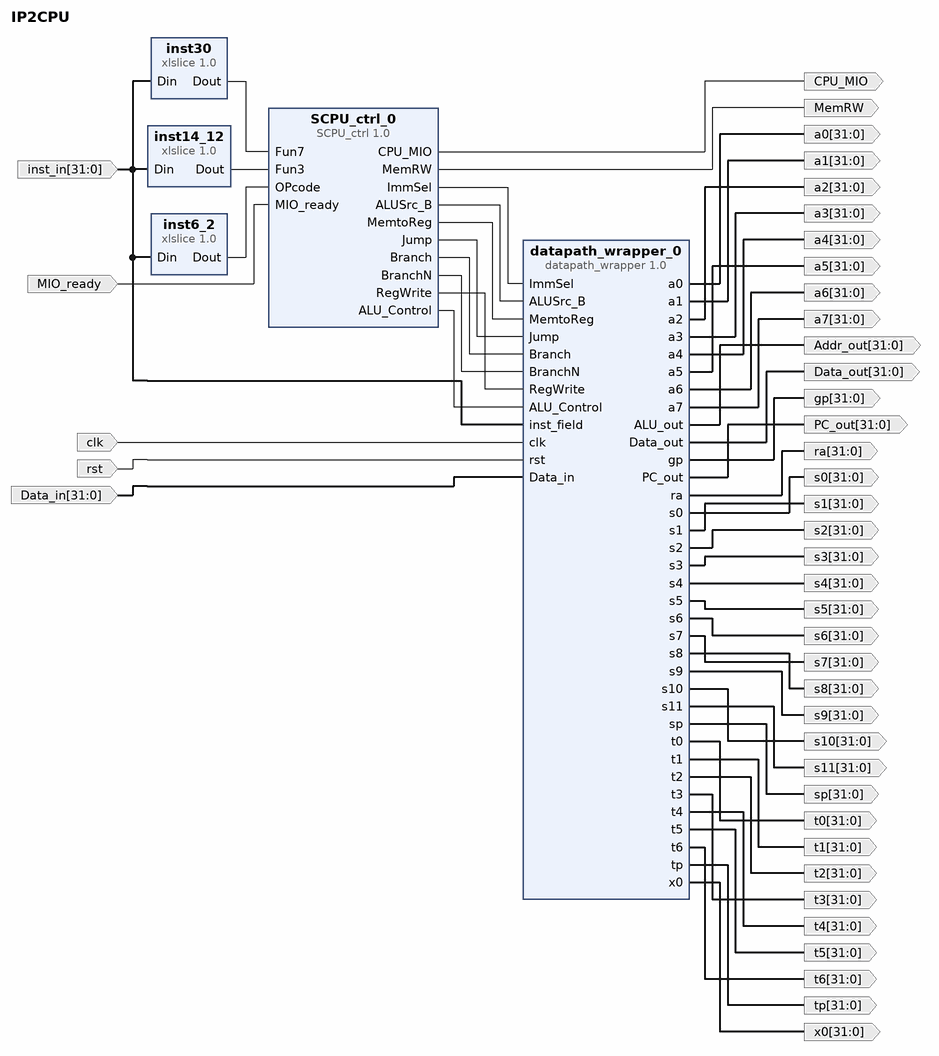
[diagram p0: block diagram of the top level]
# Vivado block design IP2CPU, xc7k160tffg676-2L, Vivado 2020.2
create_bd_design IP2CPU

create_bd_port -dir I MIO_ready
create_bd_port -dir I -type clk clk
create_bd_port -dir I -type rst rst
create_bd_port -dir I -from 31 -to 0 inst_in
create_bd_port -dir O MemRW
create_bd_port -dir O CPU_MIO
create_bd_port -dir O -from 31 -to 0 Addr_out
create_bd_port -dir O -from 31 -to 0 Data_out
create_bd_port -dir O -from 31 -to 0 PC_out
create_bd_port -dir O -from 31 -to 0 a0
create_bd_port -dir O -from 31 -to 0 a1
create_bd_port -dir O -from 31 -to 0 a2
create_bd_port -dir O -from 31 -to 0 a3
create_bd_port -dir O -from 31 -to 0 a4
create_bd_port -dir O -from 31 -to 0 a5
create_bd_port -dir O -from 31 -to 0 a6
create_bd_port -dir O -from 31 -to 0 a7
create_bd_port -dir O -from 31 -to 0 gp
create_bd_port -dir O -from 31 -to 0 ra
create_bd_port -dir O -from 31 -to 0 s0
create_bd_port -dir O -from 31 -to 0 s1
create_bd_port -dir O -from 31 -to 0 s10
create_bd_port -dir O -from 31 -to 0 s11
create_bd_port -dir O -from 31 -to 0 s2
create_bd_port -dir O -from 31 -to 0 s3
create_bd_port -dir O -from 31 -to 0 s4
create_bd_port -dir O -from 31 -to 0 s5
create_bd_port -dir O -from 31 -to 0 s6
create_bd_port -dir O -from 31 -to 0 s7
create_bd_port -dir O -from 31 -to 0 s8
create_bd_port -dir O -from 31 -to 0 s9
create_bd_port -dir O -from 31 -to 0 sp
create_bd_port -dir O -from 31 -to 0 t0
create_bd_port -dir O -from 31 -to 0 t1
create_bd_port -dir O -from 31 -to 0 t2
create_bd_port -dir O -from 31 -to 0 t3
create_bd_port -dir O -from 31 -to 0 t4
create_bd_port -dir O -from 31 -to 0 t5
create_bd_port -dir O -from 31 -to 0 t6
create_bd_port -dir O -from 31 -to 0 tp
create_bd_port -dir O -from 31 -to 0 x0
create_bd_port -dir I -from 31 -to 0 Data_in

create_bd_cell -type ip -vlnv xilinx.com:user:SCPU_ctrl:1.0 SCPU_ctrl_0
create_bd_cell -type ip -vlnv xilinx.com:user:datapath_wrapper:1.0 datapath_wrapper_0
create_bd_cell -type ip -vlnv xilinx.com:ip:xlslice:1.0 inst14_12
set_property -dict {CONFIG.DIN_FROM 14 CONFIG.DIN_TO 12 CONFIG.DOUT_WIDTH 3} [get_bd_cells inst14_12]
create_bd_cell -type ip -vlnv xilinx.com:ip:xlslice:1.0 inst30
set_property -dict {CONFIG.DIN_FROM 30 CONFIG.DIN_TO 30 CONFIG.DOUT_WIDTH 1} [get_bd_cells inst30]
create_bd_cell -type ip -vlnv xilinx.com:ip:xlslice:1.0 inst6_2
set_property -dict {CONFIG.DIN_FROM 6 CONFIG.DIN_TO 2 CONFIG.DOUT_WIDTH 5} [get_bd_cells inst6_2]

# ---- connections ----

connect_bd_net [get_bd_pins inst30/Dout] [get_bd_pins SCPU_ctrl_0/Fun7]
connect_bd_net [get_bd_pins inst14_12/Dout] [get_bd_pins SCPU_ctrl_0/Fun3]
connect_bd_net [get_bd_pins inst6_2/Dout] [get_bd_pins SCPU_ctrl_0/OPcode]
connect_bd_net -net MIO_ready_0_1 [get_bd_ports MIO_ready] [get_bd_pins SCPU_ctrl_0/MIO_ready]
connect_bd_net -net clk_0_1 [get_bd_ports clk] [get_bd_pins datapath_wrapper_0/clk]
connect_bd_net -net rst_0_1 [get_bd_ports rst] [get_bd_pins datapath_wrapper_0/rst]
connect_bd_net -net inst_field_0_1 [get_bd_ports inst_in] \
  [get_bd_pins datapath_wrapper_0/inst_field] [get_bd_pins inst14_12/Din] [get_bd_pins inst30/Din] [get_bd_pins inst6_2/Din]
connect_bd_net [get_bd_pins SCPU_ctrl_0/ImmSel] [get_bd_pins datapath_wrapper_0/ImmSel]
connect_bd_net [get_bd_pins SCPU_ctrl_0/ALUSrc_B] [get_bd_pins datapath_wrapper_0/ALUSrc_B]
connect_bd_net [get_bd_pins SCPU_ctrl_0/MemtoReg] [get_bd_pins datapath_wrapper_0/MemtoReg]
connect_bd_net [get_bd_pins SCPU_ctrl_0/Jump] [get_bd_pins datapath_wrapper_0/Jump]
connect_bd_net [get_bd_pins SCPU_ctrl_0/Branch] [get_bd_pins datapath_wrapper_0/Branch]
connect_bd_net [get_bd_pins SCPU_ctrl_0/BranchN] [get_bd_pins datapath_wrapper_0/BranchN]
connect_bd_net [get_bd_pins SCPU_ctrl_0/RegWrite] [get_bd_pins datapath_wrapper_0/RegWrite]
connect_bd_net [get_bd_pins SCPU_ctrl_0/MemRW] [get_bd_ports MemRW]
connect_bd_net [get_bd_pins SCPU_ctrl_0/CPU_MIO] [get_bd_ports CPU_MIO]
connect_bd_net [get_bd_pins SCPU_ctrl_0/ALU_Control] [get_bd_pins datapath_wrapper_0/ALU_Control]
connect_bd_net [get_bd_pins datapath_wrapper_0/ALU_out] [get_bd_ports Addr_out]
connect_bd_net [get_bd_pins datapath_wrapper_0/Data_out] [get_bd_ports Data_out]
connect_bd_net [get_bd_pins datapath_wrapper_0/PC_out] [get_bd_ports PC_out]
connect_bd_net [get_bd_pins datapath_wrapper_0/a0] [get_bd_ports a0]
connect_bd_net [get_bd_pins datapath_wrapper_0/a1] [get_bd_ports a1]
connect_bd_net [get_bd_pins datapath_wrapper_0/a2] [get_bd_ports a2]
connect_bd_net [get_bd_pins datapath_wrapper_0/a3] [get_bd_ports a3]
connect_bd_net [get_bd_pins datapath_wrapper_0/a4] [get_bd_ports a4]
connect_bd_net [get_bd_pins datapath_wrapper_0/a5] [get_bd_ports a5]
connect_bd_net [get_bd_pins datapath_wrapper_0/a6] [get_bd_ports a6]
connect_bd_net [get_bd_pins datapath_wrapper_0/a7] [get_bd_ports a7]
connect_bd_net [get_bd_pins datapath_wrapper_0/gp] [get_bd_ports gp]
connect_bd_net [get_bd_pins datapath_wrapper_0/ra] [get_bd_ports ra]
connect_bd_net [get_bd_pins datapath_wrapper_0/s0] [get_bd_ports s0]
connect_bd_net [get_bd_pins datapath_wrapper_0/s1] [get_bd_ports s1]
connect_bd_net [get_bd_pins datapath_wrapper_0/s10] [get_bd_ports s10]
connect_bd_net [get_bd_pins datapath_wrapper_0/s11] [get_bd_ports s11]
connect_bd_net [get_bd_pins datapath_wrapper_0/s2] [get_bd_ports s2]
connect_bd_net [get_bd_pins datapath_wrapper_0/s3] [get_bd_ports s3]
connect_bd_net [get_bd_pins datapath_wrapper_0/s4] [get_bd_ports s4]
connect_bd_net [get_bd_pins datapath_wrapper_0/s5] [get_bd_ports s5]
connect_bd_net [get_bd_pins datapath_wrapper_0/s6] [get_bd_ports s6]
connect_bd_net [get_bd_pins datapath_wrapper_0/s7] [get_bd_ports s7]
connect_bd_net [get_bd_pins datapath_wrapper_0/s8] [get_bd_ports s8]
connect_bd_net [get_bd_pins datapath_wrapper_0/s9] [get_bd_ports s9]
connect_bd_net [get_bd_pins datapath_wrapper_0/sp] [get_bd_ports sp]
connect_bd_net [get_bd_pins datapath_wrapper_0/t0] [get_bd_ports t0]
connect_bd_net [get_bd_pins datapath_wrapper_0/t1] [get_bd_ports t1]
connect_bd_net [get_bd_pins datapath_wrapper_0/t2] [get_bd_ports t2]
connect_bd_net [get_bd_pins datapath_wrapper_0/t3] [get_bd_ports t3]
connect_bd_net [get_bd_pins datapath_wrapper_0/t4] [get_bd_ports t4]
connect_bd_net [get_bd_pins datapath_wrapper_0/t5] [get_bd_ports t5]
connect_bd_net [get_bd_pins datapath_wrapper_0/t6] [get_bd_ports t6]
connect_bd_net [get_bd_pins datapath_wrapper_0/tp] [get_bd_ports tp]
connect_bd_net [get_bd_pins datapath_wrapper_0/x0] [get_bd_ports x0]
connect_bd_net [get_bd_ports Data_in] [get_bd_pins datapath_wrapper_0/Data_in]

validate_bd_design
save_bd_design
